# EasyEDA schematic SCH_Obsolicard_2025-10-24.json
TITLE: Obsoliboard; REV: 1.0; Date: 2025-09-07; Sheet: 1/1; Drawn By: snoms; Company: Nigga Corp
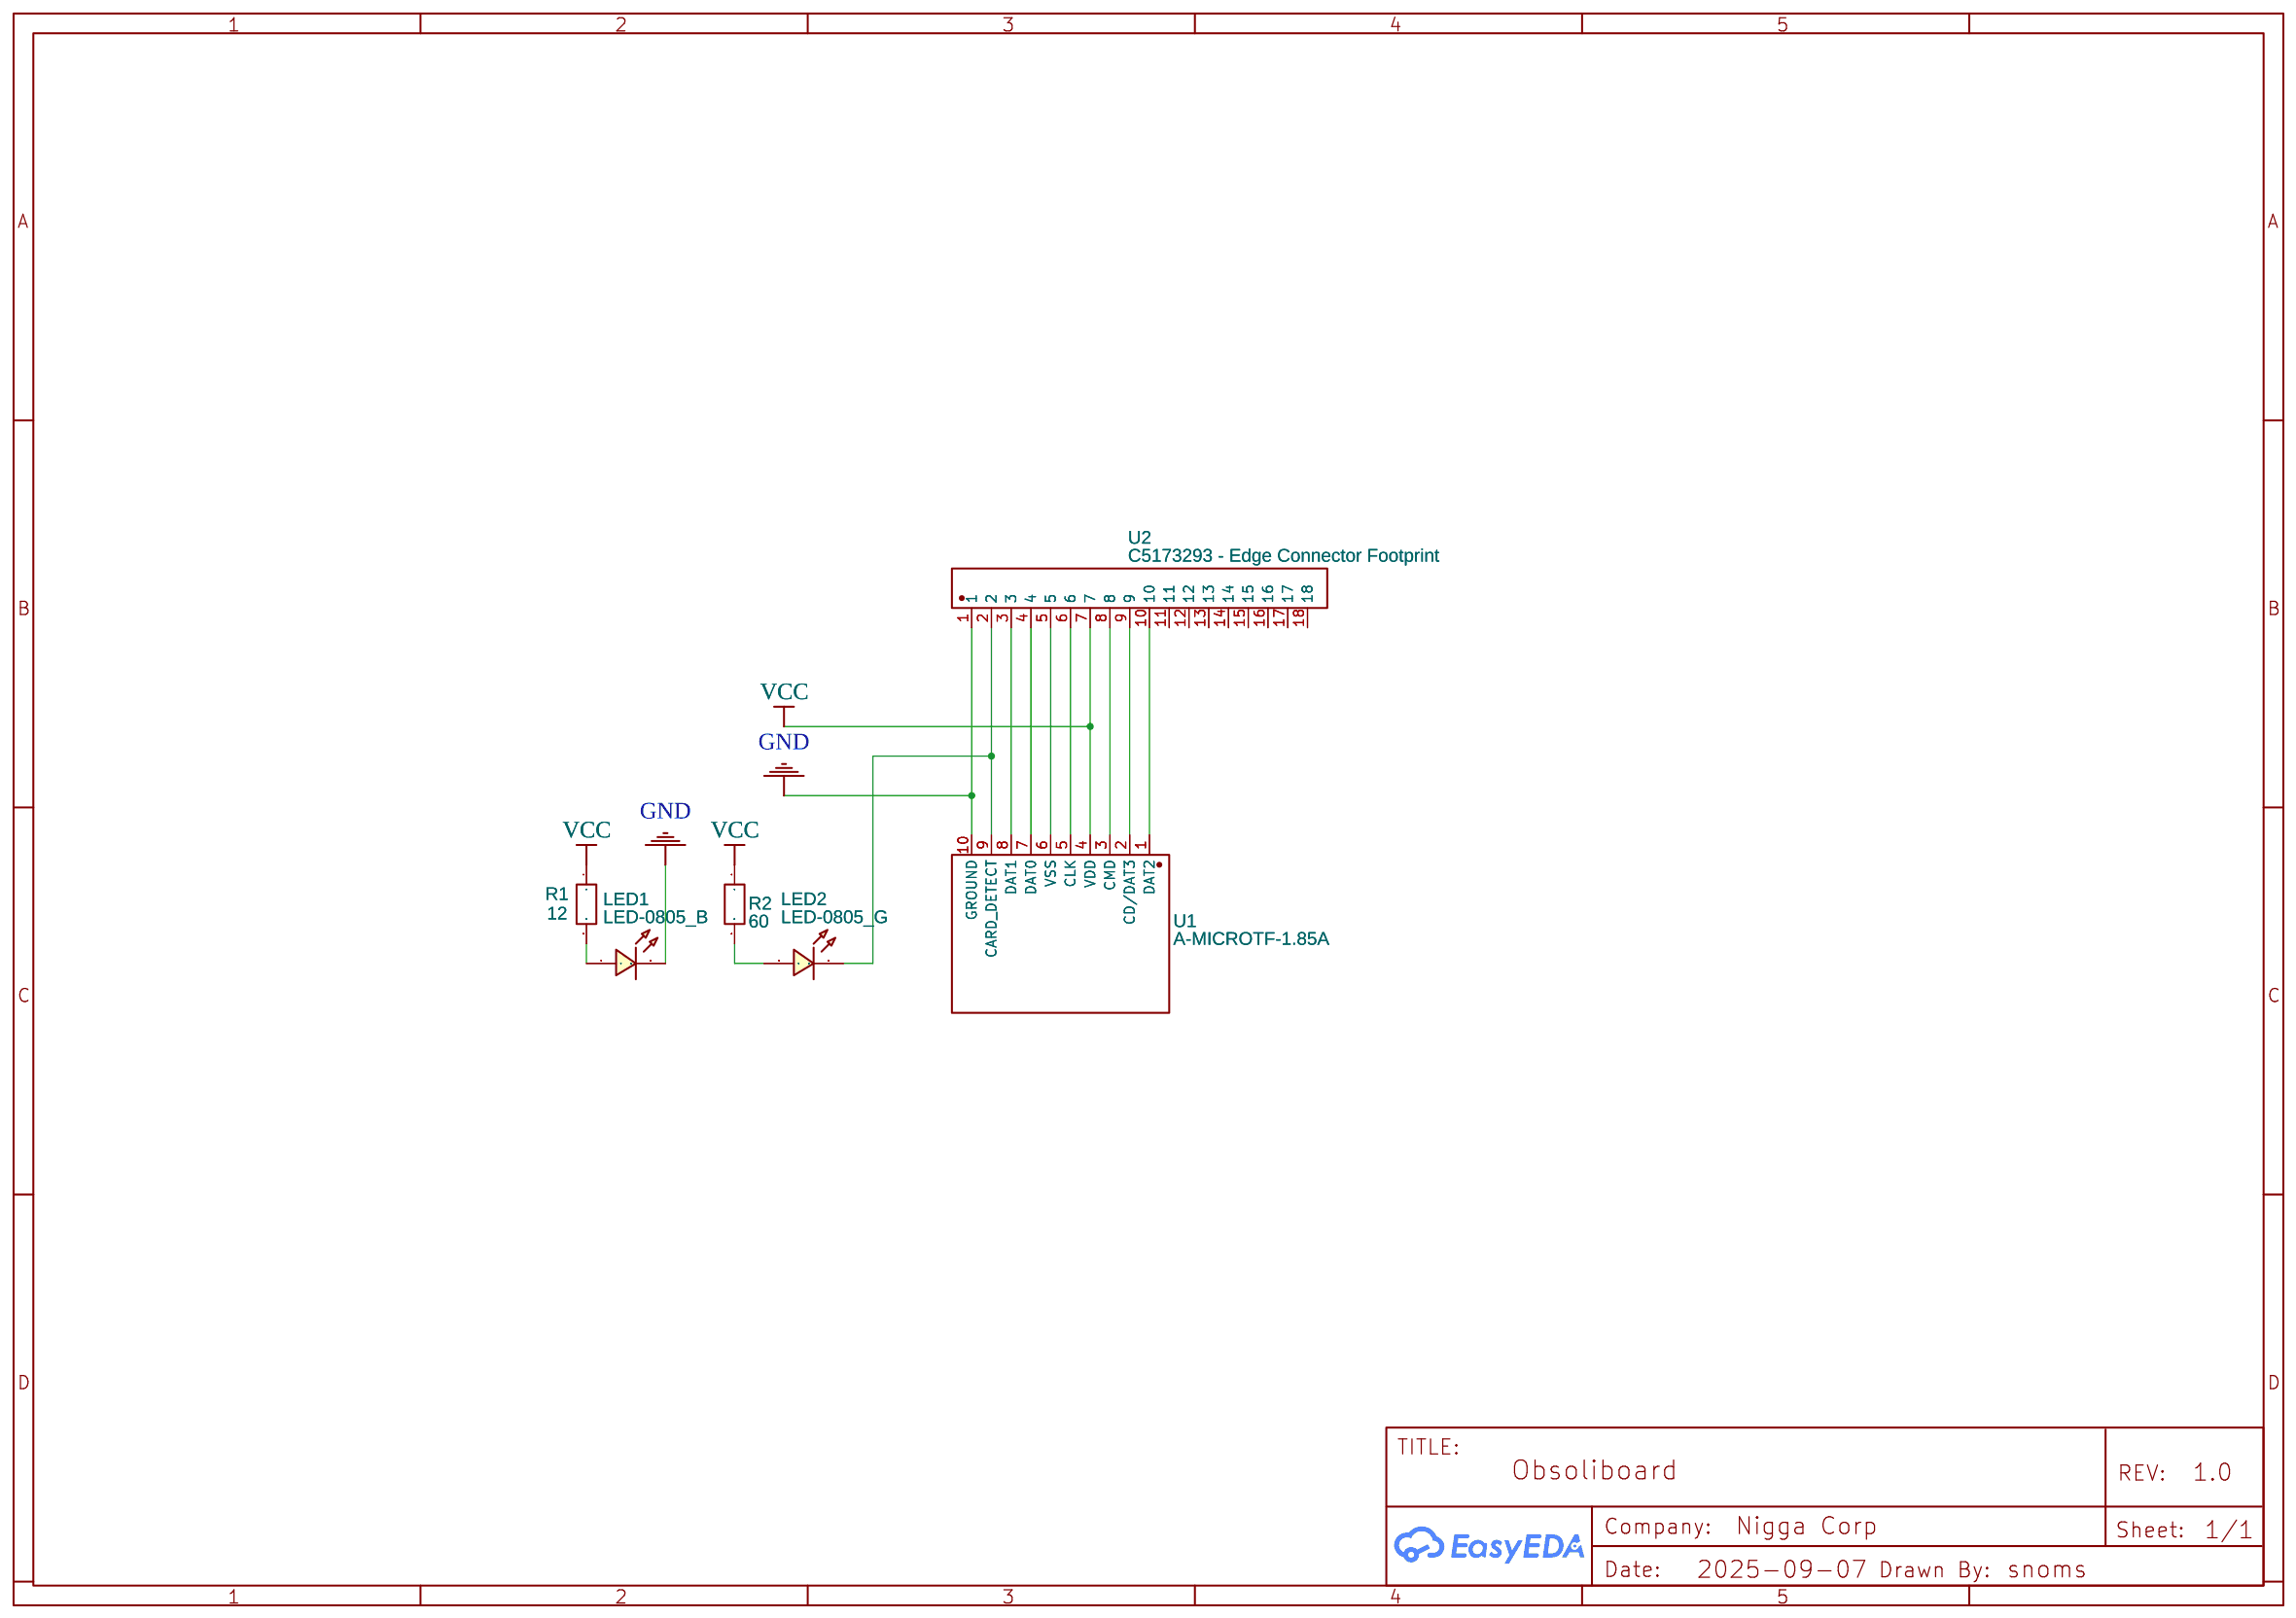
[diagram p0: schematic sheet]

## Parts
LED1  LED-0805_B  [LED0805_BLUE]
LED2  LED-0805_G  [LED0805_GREEN]
R1  12  [R0805]
R2  60  [R0805]
U1  A-MICROTF-1.85A  [TF-SMD_A-MICROTF-1.85A]
U2  C5173293 - Edge Connector Footprint  [FOOTPRINT EDGI BOY]

## Library data of the parts
LED1 = LED-0805_B: Manufacturer: YONGYUTAI; Manufacturer Part: YLED0805B; Supplier Part: C19273154; Contributor: LCEDA_Lib
LED2 = LED-0805_G: Manufacturer: Hubei KENTO Elec; Manufacturer Part: KT-0805G; Supplier Part: C2297; Contributor: LCEDA_Lib
R1 R2 = R_0805_EU: Contributor: LCEDA_Lib
U1 = A-MICROTF-1.85A: Supplier: LCSC; Supplier Part: C22467599; Manufacturer: MyAntenna(摩天射频); Manufacturer Part: A-MicroTF-1.85A; JLCPCB Part Class: Extended Part; Contributor: lcsc
U2 = C5173293 - Edge Connector Footprint: Manufacturer: WingTat; Supplier Part: C5173293; link: https://www.lcsc.com/datasheet/C5173293.pdf; Contributor: snoms

## Nets
GND: LED1.2 U1.10(GROUND) U2.1
VCC: R1.1 R2.1 U1.4(VDD) U2.7
Net-(LED1-1): LED1.1 R1.2
Net-(LED2-1): LED2.1 R2.2
Net-(LED2-2): LED2.2 U1.9(CARD_DETECT) U2.2
Net-(U1-1): U1.1(DAT2) U2.10
Net-(U1-2): U1.2(CD/DAT3) U2.9
Net-(U1-3): U1.3(CMD) U2.8
Net-(U1-5): U1.5(CLK) U2.6
Net-(U1-6): U1.6(VSS) U2.5
Net-(U1-7): U1.7(DAT0) U2.4
Net-(U1-8): U1.8(DAT1) U2.3

Not connected (* = marked no-connect by the designer): U2 11 12 13 14 15 16 17 18
